# EAGLE design SparkFun_Edge (EAGLE 9.2.0)

## Sheet 1 of 2
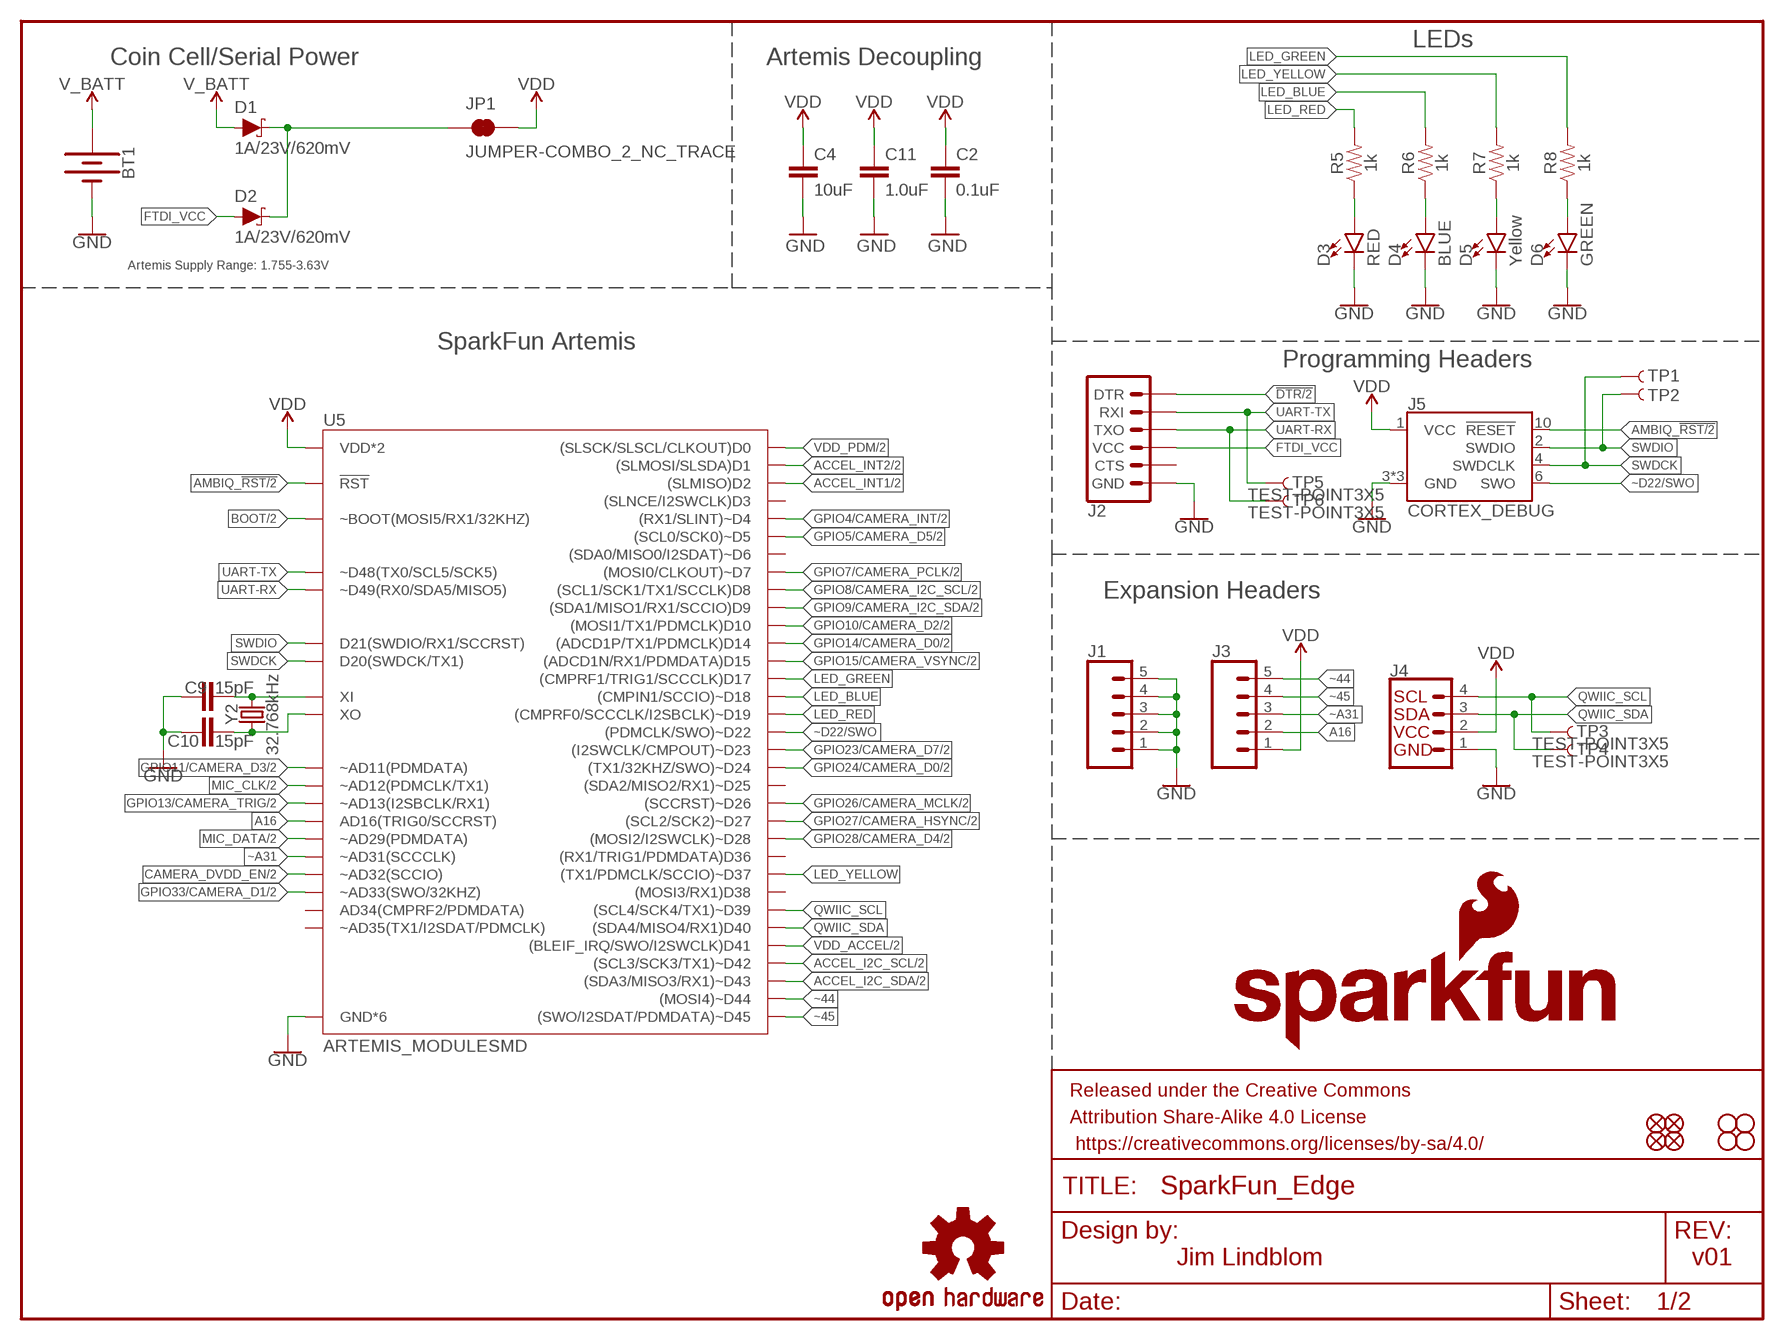
[diagram p0: schematic, sheet 1]

### Parts
BT1  BATTERY-20MM_SMD_4LEGS_OVERPASTE_INNER  [BATTCON_20MM_4LEGS_OVERPASTE_INNER]
C2  0.1uF  0.1UF-0402T-16V-10%  [0402-TIGHT]
C4  10uF  10UF-0603-6.3V-20%  [0603]
C9  15pF  15PF-0402T-50V-5%  [0402-TIGHT]
C10  15pF  15PF-0402T-50V-5%  [0402-TIGHT]
C11  1.0uF  1.0UF-0402T-16V-10%  [0402-TIGHT]
D1  1A/23V/620mV  DIODE-SCHOTTKY-BAT20J  [SOD-323]
D2  1A/23V/620mV  DIODE-SCHOTTKY-BAT20J  [SOD-323]
D3  RED  LED-RED0603  [LED-0603]
D4  BLUE  LED-BLUE0603  [LED-0603]
D5  Yellow  LED-YELLOW0603  [LED-0603]
D6  GREEN  LED-GREEN0603  [LED-0603]
FD1  FIDUCIAL1X2  [FIDUCIAL-1X2]
FD2  FIDUCIAL1X2  [FIDUCIAL-1X2]
FD3  FIDUCIAL1X2  [FIDUCIAL-1X2]
FD4  FIDUCIAL1X2  [FIDUCIAL-1X2]
FRAME1  FRAME-LETTER  [CREATIVE_COMMONS]
H1  STAND-OFF  [STAND-OFF]
H2  STAND-OFF  [STAND-OFF]
H3  STAND-OFF  [STAND-OFF]
H4  STAND-OFF  [STAND-OFF]
J1  CONN_05NO_SILK  [1X05_NO_SILK]
J2  6_PIN_SERIAL_TARGETSMD  [1X06-SMD_RA_MALE]
J3  CONN_05NO_SILK  [1X05_NO_SILK]
J4  QWIIC_CONNECTORJS-1MM  [JST04_1MM_RA]
J5  CORTEX_DEBUG  CORTEX_DEBUG_MINIMUM_PTH  [2X5-PTH-1.27MM]
JP1  JUMPER-COMBO_2_NC_TRACE  [COMBO-JUMPER_2_NC_TRACE]
LOGO1  SFE_LOGO_NAME_FLAME.1_INCH  [SFE_LOGO_NAME_FLAME_.1]
LOGO2  OSHW-LOGOS  [OSHW-LOGO-S]
R5  1k  1KOHM-0603-1/10W-1%  [0603]
R6  1k  1KOHM-0603-1/10W-1%  [0603]
R7  1k  1KOHM-0603-1/10W-1%  [0603]
R8  1k  1KOHM-0603-1/10W-1%  [0603]
TP1  TEST-POINT3X5  [PAD.03X.05]
TP2  TEST-POINT3X5  [PAD.03X.05]
TP3  TEST-POINT3X5  [PAD.03X.05]
TP4  TEST-POINT3X5  [PAD.03X.05]
TP5  TEST-POINT3X5  [PAD.03X.05]
TP6  TEST-POINT3X5  [PAD.03X.05]
U5  ARTEMIS_MODULESMD  [ARTEMIS_FP]
Y2  32.768kHz  CRYSTAL-32.768KHZSMD-3.2X1.5  [CRYSTAL-SMD-3.2X1.5MM]

### Nets
!DTR: J2.1(DTR) ; also sheet 2
A16: J3.2 U5.AD16(AD16(TRIG0/SCCRST))
ACCEL_I2C_SCL: U5.~D42((SCL3/SCK3/TX1)~D42) ; also sheet 2
ACCEL_I2C_SDA: U5.~D43((SDA3/MISO3/RX1)~D43) ; also sheet 2
ACCEL_INT1: U5.D2((SLMISO)D2) ; also sheet 2
ACCEL_INT2: U5.D1((SLMOSI/SLSDA)D1) ; also sheet 2
AMBIQ_!RST: J5.10(!RESET) U5.~RST(!RST) ; also sheet 2
BOOT: U5.BOOT(~BOOT(MOSI5/RX1/32KHZ)) ; also sheet 2
CAMERA_DVDD_EN: U5.~AD32(~AD32(SCCIO)) ; also sheet 2
FTDI_VCC: D2.A J2.4(VCC)
GND: BT1.2(-) C2.1 C4.2 C9.1 C10.1 C11.2 D3.C D4.C D5.C D6.C J1.1 J1.2 J1.3 J1.4 J1.5 J2.6(GND) J4.1 J5.3(GND) J5.5(GND) J5.9(GND) U5.GND@1(GND*6) U5.GND@22(GND*6) U5.GND@38(GND*6) U5.GND@39(GND*6) U5.GND@47(GND*6) U5.GND@59(GND*6) ; also sheet 2
GPIO4/CAMERA_INT: U5.~D4((RX1/SLINT)~D4) ; also sheet 2
GPIO5/CAMERA_D5: U5.~D5((SCL0/SCK0)~D5) ; also sheet 2
GPIO7/CAMERA_PCLK: U5.D7((MOSI0/CLKOUT)~D7) ; also sheet 2
GPIO8/CAMERA_I2C_SCL: U5.D8((SCL1/SCK1/TX1/SCCLK)D8) ; also sheet 2
GPIO9/CAMERA_I2C_SDA: U5.D9((SDA1/MISO1/RX1/SCCIO)D9) ; also sheet 2
GPIO10/CAMERA_D2: U5.D10((MOSI1/TX1/PDMCLK)D10) ; also sheet 2
GPIO11/CAMERA_D3: U5.~AD11(~AD11(PDMDATA)) ; also sheet 2
GPIO13/CAMERA_TRIG: U5.~AD13(~AD13(I2SBCLK/RX1)) ; also sheet 2
GPIO14/CAMERA_D0: U5.D14((ADCD1P/TX1/PDMCLK)D14) ; also sheet 2
GPIO15/CAMERA_VSYNC: U5.D15((ADCD1N/RX1/PDMDATA)D15) ; also sheet 2
GPIO23/CAMERA_D7: U5.~D23((I2SWCLK/CMPOUT)~D23) ; also sheet 2
GPIO24/CAMERA_D0: U5.~D24((TX1/32KHZ/SWO)~D24) ; also sheet 2
GPIO26/CAMERA_MCLK: U5.~D26((SCCRST)~D26) ; also sheet 2
GPIO27/CAMERA_HSYNC: U5.~D27((SCL2/SCK2)~D27) ; also sheet 2
GPIO28/CAMERA_D4: U5.~D28((MOSI2/I2SWCLK)~D28) ; also sheet 2
GPIO33/CAMERA_D1: U5.~AD33/SWO(~AD33(SWO/32KHZ)) ; also sheet 2
LED_BLUE: R6.2 U5.~D18((CMPIN1/SCCIO)~D18)
LED_GREEN: R8.2 U5.D17((CMPRF1/TRIG1/SCCCLK)D17)
LED_RED: R5.2 U5.~D19((CMPRF0/SCCCLK/I2SBCLK)~D19)
LED_YELLOW: R7.2 U5.~D37((TX1/PDMCLK/SCCIO)~D37)
MIC_CLK: U5.~AD12(~AD12(PDMCLK/TX1)) ; also sheet 2
MIC_DATA: U5.~AD29(~AD29(PDMDATA)) ; also sheet 2
N$2: C9.2 U5.XI Y2.P$2
N$5: D4.A R6.1
N$6: D3.A R5.1
N$7: D5.A R7.1
N$8: D6.A R8.1
QWIIC_SCL: J4.4 TP3.P$1 U5.~D39((SCL4/SCK4/TX1)~D39)
QWIIC_SDA: J4.3 TP4.P$1 U5.D40((SDA4/MISO4/RX1)D40)
SWDCK: J5.4(SWDCLK) TP1.P$1 U5.SWDCK(D20(SWDCK/TX1))
SWDIO: J5.2(SWDIO) TP2.P$1 U5.SWDIO(D21(SWDIO/RX1/SCCRST))
UART-RX: J2.3(TXO) TP6.P$1 U5.RXI-0(~D49(RX0/SDA5/MISO5))
UART-TX: J2.2(RXI) TP5.P$1 U5.TXO-0(~D48(TX0/SCL5/SCK5))
V_BATT: BT1.1(+) D1.A
VDD: C2.2 C4.1 C11.1 J3.1 J4.2 J5.1(VCC) JP1.2 JP1.4 U5.VDD@36(VDD*2) U5.VDD@37(VDD*2) ; also sheet 2
VDD_ACCEL: U5.D41((BLEIF_IRQ/SWO/I2SWCLK)D41) ; also sheet 2
VDD_PDM: U5.D0((SLSCK/SLSCL/CLKOUT)D0) ; also sheet 2
VIN1: D1.C D2.C JP1.1 JP1.3
X0: C10.2 U5.XO Y2.P$1
~44: J3.5 U5.~D44((MOSI4)~D44)
~45: J3.4 U5.~D45((SWO/I2SDAT/PDMDATA)~D45)
~A31: J3.3 U5.~AD31(~AD31(SCCCLK))
~D22/SWO: J5.6(SWO) U5.~D22((PDMCLK/SWO)~D22)
Unconnected: J2.5(CTS) U5.AD34(AD34(CMPRF2/PDMDATA)) U5.D3((SLNCE/I2SWCLK)D3) U5.D36((RX1/TRIG1/PDMDATA)D36) U5.D38((MOSI3/RX1)D38) U5.~AD35(~AD35(TX1/I2SDAT/PDMCLK)) U5.~D6((SDA0/MISO0/I2SDAT)~D6) U5.~D25((SDA2/MISO2/RX1)~D25)

### Notes on the sheet
- LEDs
- Coin Cell/Serial Power | Artemis Decoupling
- Artemis Supply Range: 1.755-3.63V
- SparkFun Artemis
- Programming Headers
- Expansion Headers
- Jim Lindblom | v01

## Sheet 2 of 2
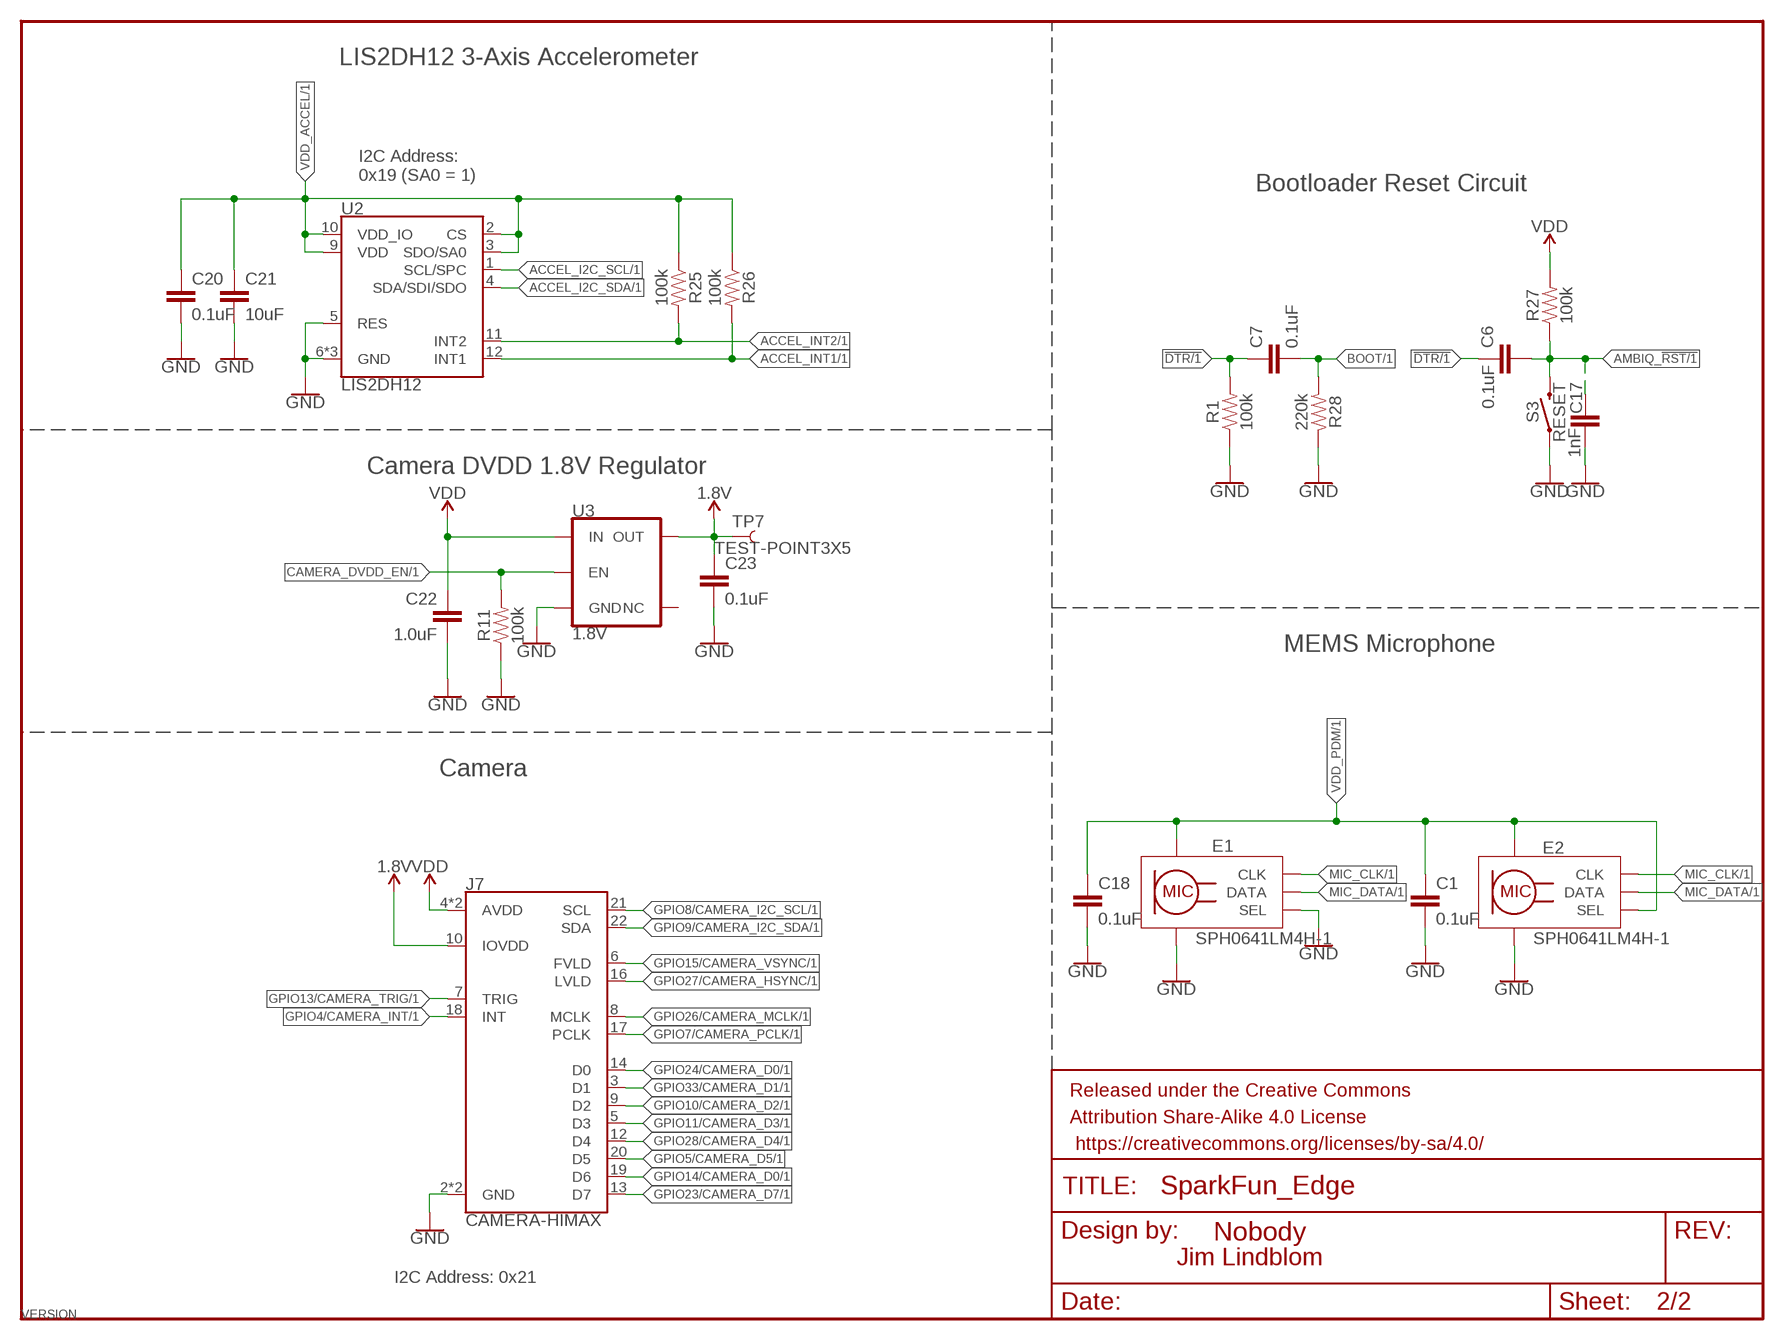
[diagram p1: schematic, sheet 2]

### Parts
C1  0.1uF  0.1UF-0402T-16V-10%  [0402-TIGHT]
C6  0.1uF  0.1UF-0603-25V-5%  [0603]
C7  0.1uF  0.1UF-0603-25V-5%  [0603]
C17  1nF  1.0NF/1000PF-0603-50V-10%  [0603]
C18  0.1uF  0.1UF-0402T-16V-10%  [0402-TIGHT]
C20  0.1uF  0.1UF-0402T-16V-10%  [0402-TIGHT]
C21  10uF  10UF-0603-6.3V-20%  [0603]
C22  1.0uF  1.0UF-0402T-16V-10%  [0402-TIGHT]
C23  0.1uF  0.1UF-0402T-16V-10%  [0402-TIGHT]
E1  SPH0641LM4H-1  SPH0641LM4H-1_MICROPHONE  [SPH0641LM4H-1_MICROPHONE]
E2  SPH0641LM4H-1  SPH0641LM4H-1_MICROPHONE  [SPH0641LM4H-1_MICROPHONE]
FRAME2  FRAME-LETTERNO_PACKAGE  [DUMMY]
J7  CAMERA-HIMAX  [FPC-24-AMPHENOL-SFV24R-1STE1HLF]
R1  100k  100KOHM-0603-1/10W-1%  [0603]
R11  100k  100KOHM-0402T-1/16W-1%  [0402-TIGHT]
R25  100k  100KOHM-0402T-1/16W-1%  [0402-TIGHT]
R26  100k  100KOHM-0402T-1/16W-1%  [0402-TIGHT]
R27  100k  100KOHM-0603-1/10W-1%  [0603]
R28  220k  220KOHM-0603-1/10W-1%  [0603]
S3  RESET  MOMENTARY-SWITCH-SPST-SMD-4.6X2.8MM  [TACTILE_SWITCH_SMD_4.6X2.8MM]
TP7  TEST-POINT3X5  [PAD.03X.05]
U2  LIS2DH12  [LGA-12-LISDH12]
U3  1.8V  V_REG_AP2127K-1.8V  [SOT23-5]

### Nets
1.8V: C23.1 J7.10(IOVDD) TP7.P$1 U3.5(OUT)
!DTR: C6.1 C7.1 R1.2 ; also sheet 1
ACCEL_I2C_SCL: U2.1(SCL/SPC) ; also sheet 1
ACCEL_I2C_SDA: U2.4(SDA/SDI/SDO) ; also sheet 1
ACCEL_INT1: R26.2 U2.12(INT1) ; also sheet 1
ACCEL_INT2: R25.2 U2.11(INT2) ; also sheet 1
AMBIQ_!RST: C6.2 C17.1 R27.1 S3.3 S3.4 ; also sheet 1
BOOT: C7.2 R28.2 ; also sheet 1
CAMERA_DVDD_EN: R11.2 U3.3(EN) ; also sheet 1
GND: C1.2 C17.2 C18.2 C20.2 C21.2 C22.2 C23.2 E1.2(SEL) E1.3(GND) E1.6(GND) E1.7(GND) E1.8(GND) E2.3(GND) E2.6(GND) E2.7(GND) E2.8(GND) J7.2(GND) J7.15(GND) R1.1 R11.1 R28.1 S3.1 S3.2 U2.5(RES) U2.6(GND) U2.7(GND) U2.8(GND) U3.2(GND) ; also sheet 1
GPIO4/CAMERA_INT: J7.18(INT) ; also sheet 1
GPIO5/CAMERA_D5: J7.20(D5) ; also sheet 1
GPIO7/CAMERA_PCLK: J7.17(PCLK) ; also sheet 1
GPIO8/CAMERA_I2C_SCL: J7.21(SCL) ; also sheet 1
GPIO9/CAMERA_I2C_SDA: J7.22(SDA) ; also sheet 1
GPIO10/CAMERA_D2: J7.9(D2) ; also sheet 1
GPIO11/CAMERA_D3: J7.5(D3) ; also sheet 1
GPIO13/CAMERA_TRIG: J7.7(TRIG) ; also sheet 1
GPIO14/CAMERA_D0: J7.19(D6) ; also sheet 1
GPIO15/CAMERA_VSYNC: J7.6(FVLD) ; also sheet 1
GPIO23/CAMERA_D7: J7.13(D7) ; also sheet 1
GPIO24/CAMERA_D0: J7.14(D0) ; also sheet 1
GPIO26/CAMERA_MCLK: J7.8(MCLK) ; also sheet 1
GPIO27/CAMERA_HSYNC: J7.16(LVLD) ; also sheet 1
GPIO28/CAMERA_D4: J7.12(D4) ; also sheet 1
GPIO33/CAMERA_D1: J7.3(D1) ; also sheet 1
MIC_CLK: E1.4(CLK) E2.4(CLK) ; also sheet 1
MIC_DATA: E1.1(DATA) E2.1(DATA) ; also sheet 1
VDD: C22.1 J7.4(AVDD) J7.11(AVDD) R27.2 U3.1(IN) ; also sheet 1
VDD_ACCEL: C20.1 C21.1 R25.1 R26.1 U2.2(CS) U2.3(SDO/SA0) U2.9(VDD) U2.10(VDD_IO) ; also sheet 1
VDD_PDM: C1.1 C18.1 E1.5(VDD) E2.2(SEL) E2.5(VDD) ; also sheet 1
Unconnected: J7.MNT1@0(MNT1) J7.MNT1@1(MNT1) J7.MNT2@0(MNT2) J7.MNT2@1(MNT2) U3.4(NC)

### Notes on the sheet
- LIS2DH12 3-Axis Accelerometer
- I2C Address:
  0x19 (SA0 = 1)
- Bootloader Reset Circuit
- Camera DVDD 1.8V Regulator
- MEMS Microphone
- Camera
- Jim Lindblom
- I2C Address: 0x21

## Library data of the parts
BT1 = SparkFun-Batteries:BATTERY: Battery - Single Cell A variety of battery chemistries, sizes, and footprints. Device List: 20MM_PTH - Coin Cell Battery Holder - 20mm (PTH) <https://www.sparkfun.com/products/783> 20MM_PTH_KIT- Coin Cell battery Holder - 20 mm (PTH) <http://www.sparkfun.com/products/783>kit version with special mask 6.8MM_PTH - Coin Cell Battery Holder - 6.8MM(SMD) <https://www.digikey.com/product-detail/en/seiko-instruments/MS621FE-FL11E/728-1057-ND/1889208?WT.srch=1&gclid=CNOQ5a6LzdQCFZS2wAodXCkE0g> 12MM_SMD - Coin Cell Battery Holder - 12mm (SMD) <https://www.sparkfun.com/products/10592> 12MM_PTH - Coin Cell Battery Holder - 12mm (PTH) <https://www.sparkfun.com/products/7948> 20MM_SMD - 20mm Coin Cell Battery Holder (SMD) (2 legs) Used on the Big Time Watch Kit <https://www.sparkfun.com/products/11734> 20MM_SMD_4LEGS - Coin Cell Battery Holder - 20mm (SMD) <https://www.sparkfun.com/products/11892> 20MM_SMD_4LEGS_OVERPASTE - Coin Cell Battery Holder - 20mm (SMD) <https://www.sparkfun.com/products/11892> (Over-paste on the legs) 24.5MM_PTH - Coin Cell Battery Holder - 24.5mm (PTH) <https://www.sparkfun.com/products/8863> 9V - 9V Battery Holder - PC Mount Used on the SparkFun SparkPunk Sound Kit <https://www.sparkfun.com/products/11177> and SparkFun SparkPunk Sequencer Kit <https://www.sparkfun.com/products/12707> 18650 - Battery Holder - 18650 (PTH) <https://www.sparkfun.com/products/13113> AA - Battery Holder - 1xAA (PTH) <https://www.sparkfun.com/products/7949> AAA - Battery Holder - 1xAAA (PTH) <https://www.sparkfun.com/products/12718> AA_KIT - Battery Holder - 1xAA (PTH) <https://www.sparkfun.com/products/7949> Special kit package - pads only have exposed copper on one side of the board. AAA_KIT - Battery Holder - 1xAAA (PTH) <https://www.sparkfun.com/products/12718> Special kit package - pads only have exposed copper on one side of the board.
C1 C2 C18 C20 C23 = SparkFun-Capacitors:0.1UF: 0.1µF ceramic capacitors A capacitor is a passive two-terminal electrical component used to store electrical energy temporarily in an electric field.; PROD_ID: CAP-12416
C4 C21 = SparkFun-Capacitors:10UF: 10.0µF ceramic capacitors A capacitor is a passive two-terminal electrical component used to store electrical energy temporarily in an electric field.; PROD_ID: CAP-11015
C6 C7 = SparkFun-Capacitors:0.1UF: 0.1µF ceramic capacitors A capacitor is a passive two-terminal electrical component used to store electrical energy temporarily in an electric field.; PROD_ID: CAP-08604
C9 C10 = SparkFun-Capacitors:15PF: 15pF ceramic capacitors A capacitor is a passive two-terminal electrical component used to store electrical energy temporarily in an electric field.; PROD_ID: CAP-13063
C11 C22 = SparkFun-Capacitors:1.0UF: 1µF ceramic capacitors A capacitor is a passive two-terminal electrical component used to store electrical energy temporarily in an electric field.; PROD_ID: CAP-12417
C17 = SparkFun-Capacitors:1.0NF/1000PF: 1nF/1,000pF ceramic capacitors A capacitor is a passive two-terminal electrical component used to store electrical energy temporarily in an electric field.; PROD_ID: CAP-07886
D1 D2 = SparkFun-DiscreteSemi:DIODE-SCHOTTKY: Schottky diode A Schottky diode is a semiconductor diode which has a low forward voltage drop and a very fast switching action.; PROD_ID: DIO-11623
D3 = SparkFun-LED:LED-RED: Red SMD LED Used in manufacturing of most products at SparkFun Packages: 0603 - SMD 0603 package [Product Link] <http://docs.avagotech.com/docs/AV02-0551EN> 0603 SMART - SMD 0603 SMART package ( more efficient and expensive)[Product Link] <http://www.osram-os.com/Graphics/XPic2/00077099_0.pdf> 1206 - SMD1206 package [Product Link] <https://www.sparkfun.com/datasheets/DevTools/LilyPad/Q150OVS4.pdff> SparkFun Products: Pro Mini 328 -5V <https://www.sparkfun.com/products/821> RedBoard <https://www.sparkfun.com/products/12757> IOIO-OTG <https://www.sparkfun.com/products/13613>; PROD_ID: DIO-00819
D4 = SparkFun-LED:LED-BLUE: Blue SMD LED Used in manufacturing of various products at SparkFun Packages: 0603 - SMD 0603 package [Product Link] <http://www.digikey.com/product-detail/en/SMLE12BC7TT86/511-1589-2-ND/1641808> 1206 - SMD1206 package [Product Link] <http://www.digikey.com/product-detail/en/lite-on-inc/LTST-C150TBKT/160-1643-1-ND/573584> SparkFun Products: ESP8266 Thing-Dev Board <https://www.sparkfun.com/products/13711> RedBoard <https://www.sparkfun.com/products/12757>; PROD_ID: DIO-08575
D5 = SparkFun-LED:LED-YELLOW: Yellow SMD LED Used in manufacturing several products at SparkFun. Packages: 0603 - SMD 0603 package[Product Link] <http://www.kingbrightusa.com/product.asp?catalog_name=LED&product_id=APT1608SYCK> 0603 -SMART - SMART SMD 0603 package (more efficient/more expensive) [Product Link] <http://www.osram-os.com/osram_os/en/products/product-catalog/led-light-emitting-diodes/smartled-0603/ly-l29k/index.jsp> LilyPad - SMD1206 package[Product Datasheet] <https://www.sparkfun.com/datasheets/DevTools/LilyPad/Q150YUS4.pdf> SparkFun Products: Blynk Board <https://www.sparkfun.com/products/13794> IOIO-OTG <https://www.sparkfun.com/products/13613> XBee Explorer Serial <https://www.sparkfun.com/products/13225>; PROD_ID: DIO-09003
D6 = SparkFun-LED:LED-GREEN: Green SMD LED Used in manufacturing of various products at SparkFun Packages: 0603 - SMD 0603 package [Product Link] <http://www.futureelectronics.com/en/technologies/semiconductors/optoelectronics/leds/Pages/9894312-LTST-C190GKT.aspx?CrossPart=HSMG-C190&IM=0> LilyPad 1206 - SMD1206 LilyPad package [Product Link] <http://www.futureelectronics.com/en/Technologies/Product.aspx?ProductID=IN150NGHARVATEKCORPORATION2049943&IM=0> 1206 - SMD1206 package [Product Link] <http://www.futureelectronics.com/en/technologies/semiconductors/optoelectronics/leds/Pages/8315665-LTST-C150KGKT.aspx?IM=0> 1206 Bottom Mount -SMD 1206 Bottom Mount [Product Link] <http://www.digikey.com/product-detail/en/lite-on-inc/LTST-C230KGKT/160-1456-1-ND/386854> SparkFun Products: Pro Mini 328 -5V <https://www.sparkfun.com/products/821> RedBoard <https://www.sparkfun.com/products/12757> MP3 Trigger <https://www.sparkfun.com/products/13720> Makey Makey <https://www.sparkfun.com/products/11076>; PROD_ID: DIO-00821
E1 E2 = SparkFun-Sensors:SPH0641LM4H-1_MICROPHONE: SPH0641LM4H-1 Microphone A miniature, high-performance, low power, bottom port silicon digital microphone with a single bit PDM output.; PROD_ID: IC-14361
FD1-FD4 = SparkFun-Aesthetics:FIDUCIAL: Fiducial Alignment Points Point-of-reference for pick-and-place machines and other optical instruments.
FRAME1 = SparkFun-Aesthetics:FRAME-LETTER: Schematic Frame - Letter Standard 8.5x11 US Letter frame
FRAME2 = SparkFun-Aesthetics:FRAME-LETTER: Schematic Frame - Letter Standard 8.5x11 US Letter frame; DESIGNER: Nobody; VERSION: x01
H1-H4 = SparkFun-Hardware:STAND-OFF: Stand Off Drill holes for mechanically mounting via screws, standoffs, etc. Note: Use the keepout ring to avoid running the screw head into surrounding components. Variant Overviews STAND-OFF - Mechanical footprint for a #4 phillips button head screw. STAND-OFF-TIGHT - Mechanical footprint for a #4 phillips button head screw, Example SparkFun Products Screw - Phillips Head (1/4", 4-40, 10 pack) <https://www.sparkfun.com/products/10453> (PRT-10453) Screw - Phillips Head (1/2", 4-40, 10 pack) <https://www.sparkfun.com/products/10452> (PRT-10452) Screw - Phillips Head (3/4", 4-40, 10 pack) <https://www.sparkfun.com/products/10451> (PRT-10451) Screw - Phillips Head (1", 4-40, 10 pack) <https://www.sparkfun.com/products/10450> (PRT-10450)
J1 J3 = SparkFun-Connectors:CONN_05: Multi connection point. Often used as Generic Header-pin footprint for 0.1 inch spaced/style header connections On any of the 0.1 inch spaced packages, you can populate with these: Break Away Headers - Straight <https://www.sparkfun.com/products/116> (PRT-00116) Break Away Male Headers - Right Angle <https://www.sparkfun.com/products/553> (PRT-00553) Female Headers <https://www.sparkfun.com/products/115> (PRT-00115) Break Away Headers - Machine Pin <https://www.sparkfun.com/products/117> (PRT-00117) Break Away Female Headers - Swiss Machine Pin <https://www.sparkfun.com/products/743> (PRT-00743) For SCREWTERMINALS and SPRING TERMINALS visit here: Screw Terimnals on SparkFun.com <https://www.sparkfun.com/search/results?term=Screw+Terminals> (5mm/3.5mm/2.54mm spacing) This device is also useful as a general connection point to wire up your design to another part of your project. Our various solder wires solder well into these plated through hole pads. Hook-Up Wire - Assortment (Stranded, 22 AWG) <https://www.sparkfun.com/products/11375> (PRT-11375) Hook-Up Wire - Assortment (Solid Core, 22 AWG) <https://www.sparkfun.com/products/11367> (PRT-11367) View the entire wire category on our website here <https://www.sparkfun.com/categories/141> Special notes: Molex polarized connector foot print use with SKU : PRT-08231 with associated crimp pins and housings. 1MM SMD Version SKU: PRT-10208
J2 = SparkFun-Connectors:6_PIN_SERIAL_TARGET: 6-pin header connection for use with the "FTDI BASIC" pinout - TARGET SIDE. Also known as "Arduino Serial Program Header". It is used to mate with our FTDI Basic serial programmers using the Arduino IDE. Note, this device has "TARGET" in the name. It is intended to be used on a design that contains a target micro-controller that you wish to program. The "sister" device, named "CABLE" is inteneded to be used on a design that usually lives on the end of your USB cable and prvides the converter chip (FTDI232 or FTDI231x) to commnicate serial RX/TX. You can populate with some of these: Break Away Headers - Straight <https://www.sparkfun.com/products/116> (PRT-00116) For reference (or to suit your programming needs) check out these designs: SparkFun FTDI Basic Breakout - 5V <https://www.sparkfun.com/products/9716> (DEV-09716) SparkFun FTDI Basic Breakout - 3.3V <https://www.sparkfun.com/products/9873> (DEV-09873) SparkFun FTDI SmartBasic <https://www.sparkfun.com/products/12935> (DEV-12935) SparkFun Beefy 3 - FTDI Basic Breakout <https://www.sparkfun.com/products/13746> (DEV-13746); PROD_ID: CONN-08971
J4 = SparkFun-Connectors:QWIIC_CONNECTOR: SparkFun I2C Standard Qwiic Connector An SMD 1mm pitch JST connector makes it easy and quick (get it? Qwiic?) to connect I2C devices to each other. The Qwiic system <http://www.sparkfun.com/qwiic> enables fast and solderless connection between popular platforms and various sensors and actuators. We carry 200mm <https://www.sparkfun.com/products/14204>, 100mm <https://www.sparkfun.com/products/14205>, 50mm <https://www.sparkfun.com/products/14206>, and breadboard friendly <https://www.sparkfun.com/products/14207> Qwiic cables. We also offer 10 pcs strips <https://www.sparkfun.com/products/14323> the SMD connectors.; PROD_ID: CONN-13694
J5 = SparkFun-Connectors:CORTEX_DEBUG_MINIMUM: Cortex Debug Connector - 10 pin Supports JTAG debug, Serial Wire debug, and Serial Wire Viewer. PTH and SMD connector options available. General Connector Information <http://infocenter.arm.com/help/topic/com.arm.doc.faqs/attached/13634/cortex_debug_connectors.pdf> Products: PTH Connector <http://www.digikey.com/product-detail/en/cnc-tech/3220-10-0100-00/1175-1627-ND/3883661> -via Digi-Key SparkFun PSoc <https://www.sparkfun.com/products/13229> SparkFun T <https://www.sparkfun.com/products/13810>
J7 = SparkFun-Connectors:CAMERA-HIMAX; DIGIKEY: 609-4320-2-ND; PROD_ID: CONN-14233
JP1 = SparkFun-Jumpers:JUMPER-COMBO_2_NC_TRACE
LOGO1 = SparkFun-Aesthetics:SFE_LOGO_NAME_FLAME: SparkFun Font Logo w/ Flame This is the SparkFun full logo. The logo on the schematic will always be the same size; the package variant is the height of the flame part of the logo. Default layer for the logo on the board is tSilk.
LOGO2 = SparkFun-Aesthetics:OSHW-LOGO: Open-Source Hardware (OSHW) Logo This logo indicates the piece of hardware it is found on incorporates a OSHW license and/or adheres to the definition of open source hardware found here: http://freedomdefined.org/OSHW
R1 R27 = SparkFun-Resistors:100KOHM: 100kΩ resistor A resistor is a passive two-terminal electrical component that implements electrical resistance as a circuit element. Resistors act to reduce current flow, and, at the same time, act to lower voltage levels within circuits. - Wikipedia; PROD_ID: RES-07828
R5-R8 = SparkFun-Resistors:1KOHM: 1kΩ resistor A resistor is a passive two-terminal electrical component that implements electrical resistance as a circuit element. Resistors act to reduce current flow, and, at the same time, act to lower voltage levels within circuits. - Wikipedia; PROD_ID: RES-07856
R11 R25 R26 = SparkFun-Resistors:100KOHM: 100kΩ resistor A resistor is a passive two-terminal electrical component that implements electrical resistance as a circuit element. Resistors act to reduce current flow, and, at the same time, act to lower voltage levels within circuits. - Wikipedia; PROD_ID: RES-13495
R28 = SparkFun-Resistors:220KOHM: 220kΩ resistor A resistor is a passive two-terminal electrical component that implements electrical resistance as a circuit element. Resistors act to reduce current flow, and, at the same time, act to lower voltage levels within circuits. - Wikipedia; PROD_ID: RES-08969
S3 = SparkFun-Switches:MOMENTARY-SWITCH-SPST: Momentary Switch (Pushbutton) - SPST Normally-open (NO) SPST momentary switches (buttons, pushbuttons). Variants PTH-12MM - 12mm square, through-hole Momentary Pushbutton Switch - 12mm Square <https://www.sparkfun.com/products/9190> (COM-09190) PTH-6.0MM, PTH-6.0MM-KIT - 6.0mm square, through-hole Mini Pushbutton Switch <https://www.sparkfun.com/products/97> (COM-00097) KIT package intended for soldering kit's - only one side of pads' copper is exposed. PTH-RIGHT-ANGLE-KIT - Right-angle, through-hole Right Angle Tactile Button <https://www.sparkfun.com/products/10791> - Used on SparkFun BigTime Watch Kit <https://www.sparkfun.com/products/11734> SMD-12MM - 12mm square, surface-mount Tactile Button - SMD (12mm) <https://www.sparkfun.com/products/12993> (COM-12993) Used on SparkFun PicoBoard <https://www.sparkfun.com/products/11888> SMD-4.5MM - 4.5mm Square Trackball Switch Used on SparkFun Blackberry Trackballer Breakout <https://www.sparkfun.com/products/13169> SMD-4.6MMX2.8MM - 4.60mm x 2.80mm, surface mount Used on SparkFun SAMD21 Mini Breakout <https://www.sparkfun.com/products/13664> SMD-5.2MM, SMD-5.2-REDUNDANT - 5.2mm square, surface-mount Mini Pushbutton Switch - SMD <https://www.sparkfun.com/products/8720> (COM-08720) Used on Arduino Pro Mini <https://www.sparkfun.com/products/11114> REDUNDANT package connects both switch circuits together SMD-6.0X3.5MM - 6.0 x 3.5mm, surface mount Momentary Reset Switch SMD <https://www.sparkfun.com/products/8229> (COM-08229) SMD-6.2MM-TALL - 6.2mm square, surface mount Tactile Button - SMD (6mm) <https://www.sparkfun.com/products/12992> Used on SparkFun Digital Sandbox <https://www.sparkfun.com/products/12651> SMD-RIGHT-ANGLE - Right-angle, surface mount Used on SparkFun Block for Intel® Edison - Arduino <https://www.sparkfun.com/products/13036>; PROD_ID: SWCH-13065
TP1-TP7 = SparkFun-Connectors:TEST-POINT: SparkFun Test Points Bare copper test points for troubleshooting or In-Circuit-Testing. These are used by our Production team for verifying production board runs using pogo-pins on test beds. SparkFun Products: SparkFun LSM9DS1 Breakout <https://www.sparkfun.com/products/13284> SparkFun PSOC <https://www.sparkfun.com/products/13714> SparkFun Load Cell Amplifier <https://www.sparkfun.com/products/13879>
U2 = SparkFun-Sensors:LIS2DH12; DIGIKEY: 497-14851-2-ND; PROD_ID: IC-14229
U3 = SparkFun-IC-Power:V_REG_AP2127: AP2127 - 300mA CMOS LDO Regulator w/ Enable The AP2127 is CMOS process low dropout linear regulator with enable function, the regulator delivers a guaranteed 300mA (min.) continuous load current. Features Output Voltage Accuracy: ±1.5% Output Current: 300mA (Min.) Foldback Short Current Protection: 50mA Enable Function to Turn ON/OFF VOUT Low Dropout Voltage (3.3V): 250mV (Typ.) @IOUT=600mA Excellent Load Regulation: 0.2%/A (Typ.) Excellent Line Regulation: 0.02%/V (Typ.) Low Quiescent Current: 55μA (Typ.) Low Standby Current: 0.01μA (Typ.) Low Output Noise: 50μVRMS PSRR: 100Hz -65dB, 1kHz -65dB OTSD Protection Stable with 1.0μF Flexible Cap: Ceramic, Tantalum and Aluminum Electrolytic Operation Temperature Range: -40°C to 85°C ESD: MM 400V, HBM 4000V; PROD_ID: VREG-14239
U5 = SparkFun-IC-Microcontroller:ARTEMIS_MODULE: Description: The Artemis Module from SparkFun is a Cortex-M4F with BLE 5.0 running up to 96MHz and with as low power as 6uA per MHz (less than 5mW). This is the world's first module to bridge the market between hobbyists and consumer products. We've packaged all the power of a modern microcontroller into a module that is both extremely easy to use but is mass-market ready. The flexibility of the Artemis module starts with our [Arduino core](https://github.com/sparkfun/Arduino_Apollo3). You can program and use the Artemis module just like you would an Uno or any other Arduino. Time to first blink is just 5 minutes away! We built the core from the ground up, making it fast and as light weight as possible.; PROD_ID: SUB-14402
Y2 = SparkFun-Clocks:CRYSTAL-32.768KHZ: 32.768kHz Crystal Frequency: 32.768kHz Frequency Stability: ±20ppm Load Capacitance: 12.5pF (PTH-2X6 & SMD-3.2X1.5), 6pF (SMD-2X6) SparkFun Products: SparkFun BigTime Watch Kit <https://www.sparkfun.com/products/11734> SparkFun nRF52832 Breakout <https://www.sparkfun.com/products/13990> SparkFun Real Time Clock Module <https://www.sparkfun.com/products/12708>; PROD_ID: XTAL-13062

## Net classes
2 usb: width 0.254 mm, drill 0.305 mm, clearance 0.254 mm

## Board
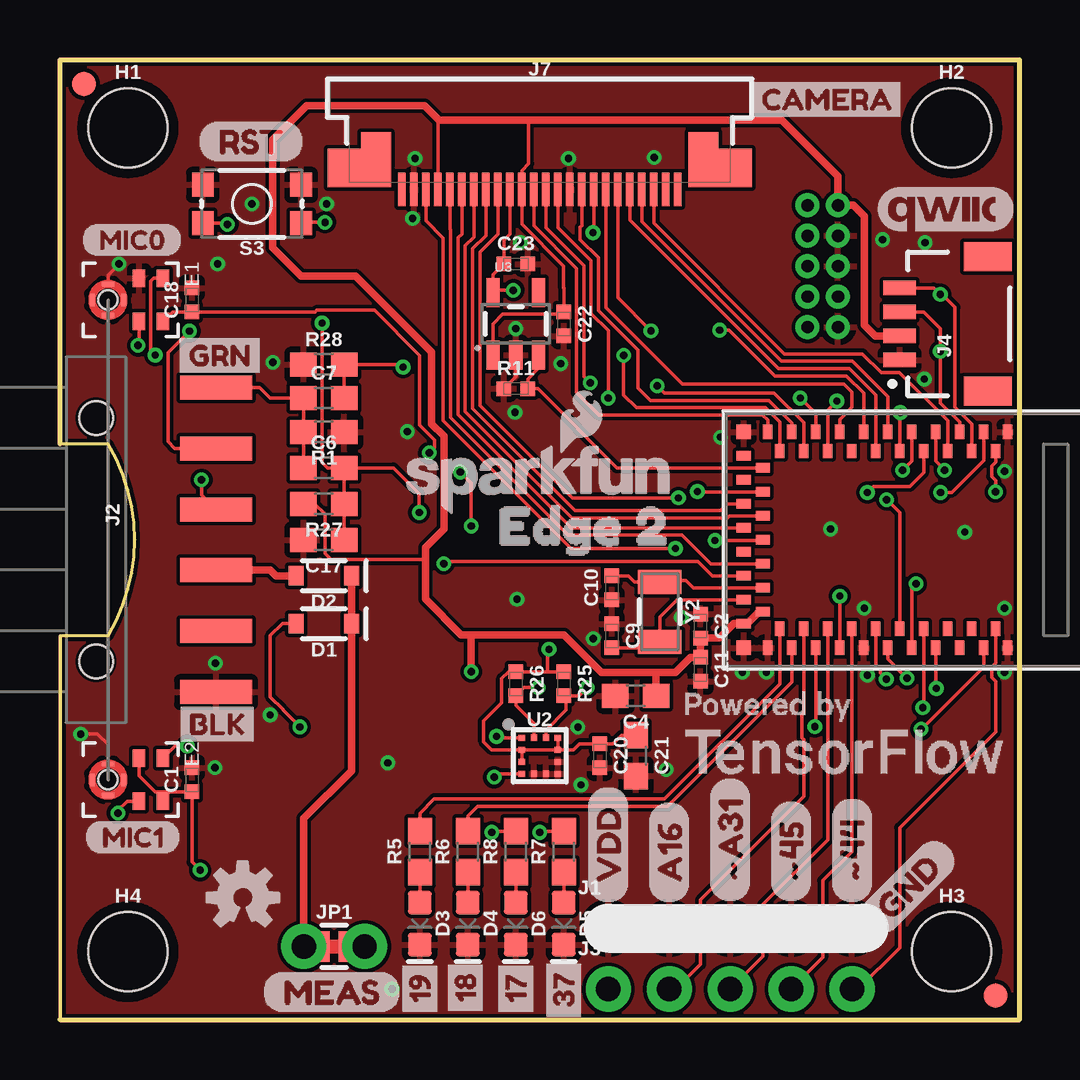
[diagram p2: board, top side]
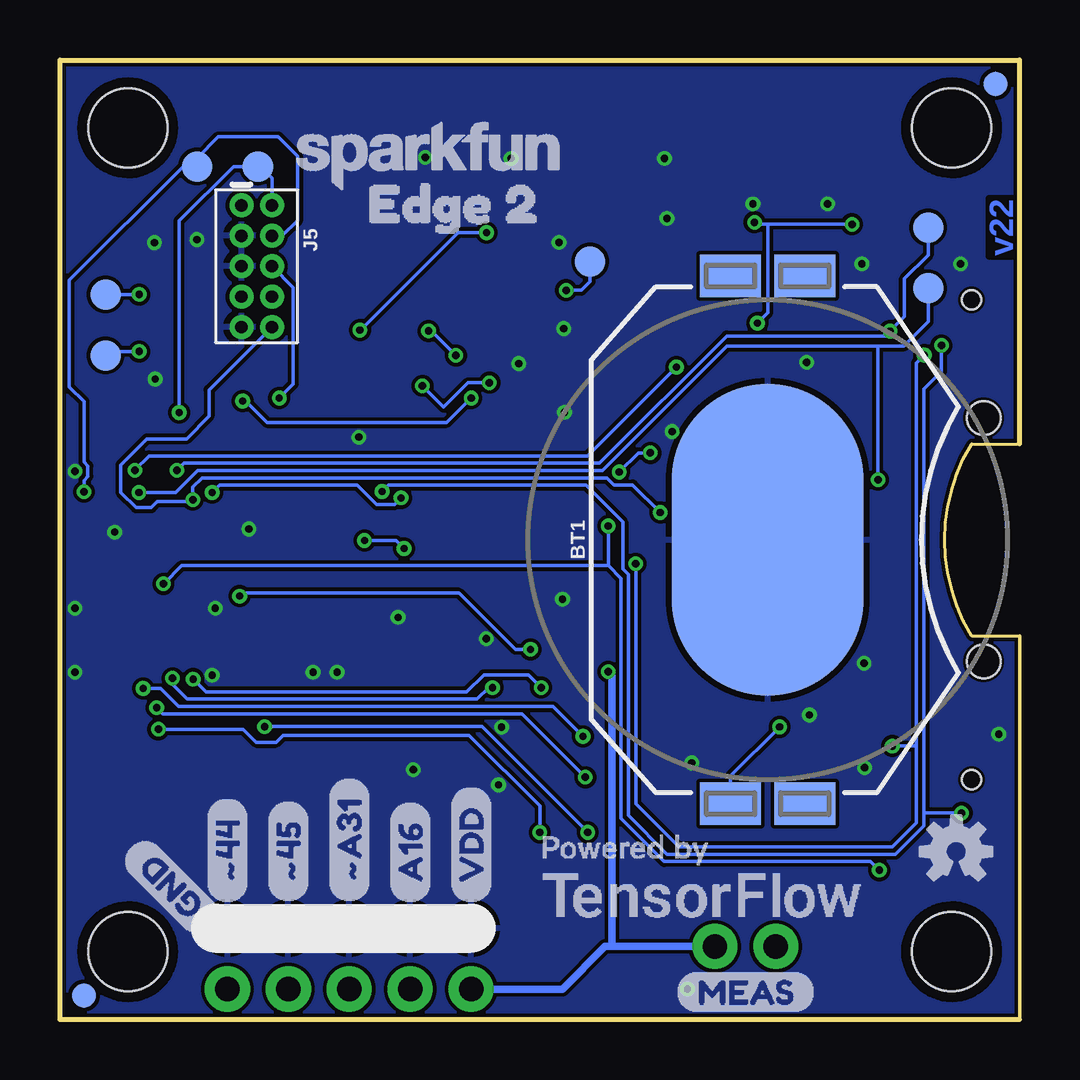
[diagram p3: board, bottom side, seen from below]

Size 40 x 40 mm. Coordinates in mm from the lower left corner, seen from the top.
Outline: 0,0 40,0 40,40 0,40 0,24 2,24 arc-62 2,16 0,16 0,0
Copper layers (1*16): Top 0.035mm / dielectric 1.5mm / Bottom 0.035mm
Design rules "SparkFun-2-layer-PCBWay-LIMIT *": minimum track width 6mil, minimum drill 0.3mm, track to track 6mil, track to pad 6mil, pad to pad 6mil, via to via 6mil, smd to smd 6mil, copper to edge 6mil, drill to drill 6mil, minimum pad ring 6mil, minimum via ring 6mil, stop-mask expansion 4mil, vias tented up to drill 25mil, thermal gap 10mil

### Footprints (pad centres in the part's own frame; a part is rotated, then mirrored left to right if it is on the bottom)
BATTCON_20MM_4LEGS_OVERPASTE_INNER = smd 1.778 x 2.54: 1 -11,1.55; 3 11,1.55; P$1 -11,-1.55; P$2 11,-1.55 | smd 13 x 8: 2 0,0
0402-TIGHT = smd 0.6 x 0.6: 1 -0.5,0; 2 0.5,0
0603 = smd 1.1 x 1: 1 -0.85,0; 2 0.85,0
SOD-323 = smd 0.63 x 0.83: A 1.15,0; C -1.15,0
LED-0603 = smd 1 x 1: A -0.877,0; C 0.877,0
SPH0641LM4H-1_MICROPHONE = smd 0.725 x 0.522: 1 -0.9,1.3; 2 -0.9,0.3; 4 0.9,0.3; 5 0.9,1.3 | smd 0.5 x 0.2: 3 0,-1.65; 8 0,-0.35 | smd 0.2 x 0.5: 6 -0.65,-1; 7 0.65,-1 | hole 0.8: 0,-1
FIDUCIAL-1X2 = smd 1 x 1: 1 0,0
STAND-OFF = hole 3.302: 0,0
1X05_NO_SILK = drill 1.016 pad 1.88: 1 0,0; 2 2.54,0; 3 5.08,0; 4 7.62,0; 5 10.16,0
1X06-SMD_RA_MALE = smd 1 x 3: 1 -6.35,5; 2 -3.81,5; 3 -1.27,5; 4 1.27,5; 5 3.81,5; 6 6.35,5 | hole 1.4: -5.08,0; 5.08,0
JST04_1MM_RA = smd 0.6 x 1.35: 1 -1.5,0; 2 -0.5,0; 3 0.5,0; 4 1.5,0 | smd 1.2 x 2: NC1 2.8,-3.675; NC2 -2.8,-3.675
2X5-PTH-1.27MM = drill 0.508 pad 1: 1 -2.54,-0.635; 2 -2.54,0.635; 3 -1.27,-0.635; 4 -1.27,0.635; 5 0,-0.635; 6 0,0.635; 7 1.27,-0.635; 8 1.27,0.635; 9 2.54,-0.635; 10 2.54,0.635
FPC-24-AMPHENOL-SFV24R-1STE1HLF = smd 0.3 x 1.4: 1 5.75,2.4; 2 5.25,2.4; 3 4.75,2.4; 4 4.25,2.4; 5 3.75,2.4; 6 3.25,2.4; 7 2.75,2.4; 8 2.25,2.4; 9 1.75,2.4; 10 1.25,2.4; 11 0.75,2.4; 12 0.25,2.4; 13 -0.25,2.4; 14 -0.75,2.4; 15 -1.25,2.4; 16 -1.75,2.4; 17 -2.25,2.4; 18 -2.75,2.4; 19 -3.25,2.4; 20 -3.75,2.4; 21 -4.25,2.4; 22 -4.75,2.4; 23 -5.25,2.4; 24 -5.75,2.4 | smd 1.4 x 1.6: MNT1@0 -8.15,1.5; MNT2@1 8.15,1.5 | smd 1.25 x 2.3: MNT1@1 -6.825,1.15; MNT2@0 6.825,1.15
COMBO-JUMPER_2_NC_TRACE = smd 0.635 x 1.27: 1 -0.508,0; 2 0.508,0 | drill 1.016 pad 1.88: 3 -1.27,0; 4 1.27,0
TACTILE_SWITCH_SMD_4.6X2.8MM = smd 0.9 x 1: 1 -2.05,-0.8; 2 2.05,-0.8; 3 2.05,0.8; 4 -2.05,0.8
PAD.03X.05 = smd 1.27 x 1.27: P$1 0,0
LGA-12-LISDH12 = smd 0.275 x 0.25: 1 -0.75,0.75; 2 -0.75,0.25; 3 -0.75,-0.25; 4 -0.75,-0.75; 7 0.75,-0.75; 8 0.75,-0.25; 9 0.75,0.25; 10 0.75,0.75 | smd 0.25 x 0.275: 5 -0.25,-0.75; 6 0.25,-0.75; 11 0.25,0.75; 12 -0.25,0.75
SOT23-5 = smd 0.55 x 1.2: 1 -0.95,-1.3; 2 0,-1.3; 3 0.95,-1.3; 4 0.95,1.3; 5 -0.95,1.3
ARTEMIS_FP = smd 0.4 x 0.6: AD16 -4,-3.7; BOOT 1.5,4.5; D0 0.5,-4.5; D1 -0.5,-4.5; D2 -1,-3.7; D3 2,-3.7; D7 -1.5,4.5; D8 -0.5,4.5; D9 2,3.7; D10 1,3.7; D14 -5,3.7; D17 -3.5,-4.5; D36 2.5,-4.5; D38 3,-3.7; D40 2.5,4.5; D41 -2.5,-4.5; GND@1 4.5,4.5; GND@39 -5.5,-4.5; GND@47 -1.5,-4.5; GND@59 4.5,-4.5; RXI-0 3.5,4.5; SWDCK 4,3.7; SWDIO 0,3.7; TXO-0 0.5,4.5; ~AD31 -3,-3.7; ~AD35 -2,3.7; ~D4 -2.5,4.5; ~D5 -1,3.7; ~D18 -4.5,-4.5; ~D19 -5,-3.7; ~D22 -3.5,4.5; ~D23 -4,3.7; ~D24 -3,3.7; ~D27 -4.5,4.5; ~D28 -5.5,4.5; ~D37 3.5,-4.5; ~D39 3,3.7; ~D42 1.5,-4.5; ~D43 1,-3.7; ~D44 4,-3.7; ~D45 -2,-3.7; ~RST 0,-3.7 | smd 0.6 x 0.4: AD34 -6.5,-0.5; D15 -6.5,0.5; VDD@36 -5.7,-3; VDD@37 -6.5,-3.5; XI -6.5,-2.5; XO -5.7,-2; ~AD11 -5.7,-1; ~AD12 -5.7,2; ~AD13 -5.7,1; ~AD29 -6.5,-1.5; ~AD32 -5.7,3; ~AD33/SWO -5.7,0; ~D6 -6.5,3.5; ~D25 -6.5,2.5; ~D26 -6.5,1.5 | smd 0.6 x 0.6: GND@22 -6.5,4.5; GND@38 -6.5,-4.5
CRYSTAL-SMD-3.2X1.5MM = smd 1 x 1.8: P$1 -1.25,0; P$2 1.25,0

### Placement (x,y rotation side)
BT1  10.5,20 90 bottom
C1  5.5,10 90 top
C2  26.7,16.4 270 top
C4  24,13.5 180 top
C6  11,23 0 top
C7  11,25.9 0 top
C9  23,16 270 top
C10  23,18 90 top
C11  26.7,14.6 270 top
C17  11,20 180 top
C18  5.5,30 90 top
C20  22.5,11 270 top
C21  24,11 270 top
C22  21,29 270 top
C23  19,31.5 0 top
D1  11,16.5 180 top
D2  11,18.5 180 top
D3  15,4 270 top
D4  17,4 270 top
D5  21,4 270 top
D6  19,4 270 top
E1  3,30 270 top
E2  3,10 270 top
FD1  1,39 0 top
FD2  39,1 0 top
FD3  39,1 0 bottom
FD4  1,39 0 bottom
FRAME1  1,-13 0 top  (outside the outline)
FRAME2  1,-13 0 top  (outside the outline)
H1  2.83,37.17 0 top
H2  37.17,37.17 0 top
H3  37.17,2.83 0 top
H4  2.83,2.83 0 top
J1  22.86,3.81 0 top
J2  1.5,20 270 top
J3  22.86,1.27 0 top
J4  35,29 90 top
J5  31.8,31.4 270 bottom
J7  20,37 180 top
JP1  11.43,3.05 0 top
LOGO1  20,22.52 0 top
LOGO2  7.62,5.08 0 top
R1  11,24.5 180 top
R5  15,7 90 top
R6  17,7 90 top
R7  21,7 90 top
R8  19,7 90 top
R11  19,26.3 0 top
R25  21,14 270 top
R26  19,14 270 top
R27  11,21.5 180 top
R28  11,27.3 0 top
S3  8,34 180 top
TP1  34.29,35.56 0 bottom
TP2  31.75,35.56 0 bottom
TP3  38.1,30.23 0 bottom
TP4  38.1,27.69 0 bottom
TP5  3.81,33.02 0 bottom
TP6  3.81,30.48 0 bottom
TP7  17.9,31.6 0 bottom
U2  20,11 0 top
U3  19,29 0 top
U5  35,20 0 top
U$1  [MIC00]  0.9,32.5 0 top
U$2  [BLK2]  4.57,12.32 0 top
U$3  [GND0]  33.66,3.81 45 top
U$4  [VDD1]  22.86,4.83 90 top
U$5  [#453]  30.48,4.83 90 top
U$6  [#A312]  27.94,4.83 90 top
U$7  [A161]  25.4,4.83 90 top
U$8  [MIC10]  1,7.6 0 top
U$9  [VDD1]  22.86,4.83 90 bottom
U$10  [A161]  25.4,4.83 90 bottom
U$11  [#A312]  27.94,4.83 90 bottom
U$12  [#453]  30.48,4.83 90 bottom
U$13  [#444]  33.02,4.83 90 bottom
U$14  [GND0]  33.66,3.81 135 bottom
U$15  [EDGE_20]  16.89,20.57 0 top
U$16  [372]  21,-0.3 90 top
U$19  [QWIIC_COPYRIGHT_SMALL]  36.9,33.8 0 top
U$20  [CAMERA3]  28.45,38.35 0 top
U$21  [POWEREDBY_TF#JPG]  32.6,12.2 0 top
U$23  [171]  19,-0.1 90 top
U$24  [MEAS10]  14.35,1.14 0 bottom
U$25  [POWEREDBY_TF#JPG]  13.34,6.22 0 bottom
U$26  [182]  16.9,-0.1 90 top
U$27  [RST15]  5.7,36.6 0 top
U$28  [GRN1]  4.57,27.69 0 top
U$29  [SFE_LOGO_NAME_.1]  24.64,36 0 bottom
U$30  [OSHW-LOGO-S]  2.64,7 0 bottom
U$31  [193]  15,-0.1 90 top
U$32  [EDGE_20]  28.54,34 0 bottom
U$35  [MEAS10]  8.38,1.14 0 top
U$36  [#444]  33.02,4.83 90 top
Y2  25,17 270 top

### Tracks (layer width: path | path; a pad name or v marks a point on that pad's centre or on a via)
1.8V  (via drill 0.3)
  Top 0.152: J7.10 18.75,33.53 18.75,32.75 18.5,32.5 C23.1 18.05,31.05 U3.5 18.15,30.4 v18.9,30.4
  Bottom 0.152: TP7.P$1 17.9,30.77 18.27,30.4 v18.9,30.4
!DTR
  Top 0.152: J2.1 8.32,26.35 8.76,25.91 8.76,25.9 C7.1 R1.2 C6.1
A16
  Top 0.152: J3.2 25.67,1.27 26.7,2.3 26.7,5 31,9.3 31,11.67 30.93,11.74 30.93,12.69 31,12.75 U5.AD16
ACCEL_I2C_SCL  (via drill 0.3)
  Top 0.152: U2.1 18.25,11.75 v18.2,11.8 | U5.~D42 36.5,13.83 v36.53,13.8
  Bottom 0.152: v36.53,13.8 35.8,13.8 35.05,13.05 19.45,13.05 v18.2,11.8
ACCEL_I2C_SDA  (via drill 0.3)
  Top 0.152: U2.4 18.25,10.25 v18.1,10.1 | U5.~D43 36,13.03 v35.97,13
  Bottom 0.152: v35.97,13 35.71,12.75 20.75,12.75 v18.1,10.1
ACCEL_INT1  (via drill 0.3)
  Top 0.152: U2.12 19.75,12.35 19,13.1 R26.2 19.34,13.84 v19.94,13.84 | U5.D2 34,14.76 34.19,14.57 34.19,14.45 v34.45,14.19
  Bottom 0.152: v19.94,13.84 20.47,14.37 22.33,14.37 23.04,13.66 33.91,13.66 v34.45,14.19
ACCEL_INT2  (via drill 0.3)
  Top 0.152: U2.11 20.25,12.05 21.1,12.9 21.1,13.4 R25.2 21.63,13.5 v21.97,13.84 | v35.31,14.22 34.5,15.03 U5.D1
  Bottom 0.152: v21.97,13.84 22.12,13.84 22.61,13.36 34.69,13.36 35.31,13.97 v35.31,14.22
AMBIQ_!RST  (via drill 0.3)
  Top 0.152: C17.1 R27.1 11.85,22.95 11.8,23 | v14.97,21.14 14.97,21.93 13.9,23 C6.2 11.8,23 | v34.47,21.67 35,21.14 U5.~RST | 11.8,23 11.15,23 10.93,23.22 v10.93,29.03 | v11.05,33.23 10.08,33.23 S3.4 | S3.3 6.93,33.2 v6.99,33.15
  Bottom 0.152: v14.97,21.14 16.12,22.29 16.91,22.29 17.2,22.58 34.08,22.58 34.47,22.2 v34.47,21.67 34.55,21.59 35.94,21.59 36.2,21.34 36.83,21.34 37.47,21.97 37.47,23.12 36.38,24.2 34.73,24.2 33.78,25.15 33.78,26.24 J5.10 | v10.93,29.03 10.5,29.46 10.5,33.11 10.54,33.15 | v6.99,33.15 10.54,33.15 | 10.54,33.15 10.96,33.15 v11.05,33.23
BOOT  (via drill 0.3)
  Top 0.152: C7.2 R28.2 14.2,27.3 v14.3,27.2 | U5.BOOT 36.5,23.28 v36.88,22.9
  Bottom 0.152: v36.88,22.9 36.29,23.5 18,23.5 v14.3,27.2
CAMERA_DVDD_EN
  Top 0.152: U5.~AD32 23.22,23 19.92,26.3 R11.2 19.5,26.7 19.95,27.15 U3.3
FTDI_VCC
  Top 0.305: J2.4 8.77,18.73 9,18.5 D2.A
GND  (via drill 0.3)
  Top 0.152: U3.2 19,26.8 R11.1 | E1.6 1.98,30.63 1.74,30.63 1.37,30.26 1.37,30.02 E1.3 1.37,29.98 1.37,29.74 1.74,29.37 1.98,29.37 E1.7 2.02,29.37 2.26,29.37 2.63,29.74 2.63,29.98 E1.8 2.63,30.02 2.63,30.26 2.26,30.63 2.02,30.63 E1.6 | E1.6 2,31.04 v2.46,31.5 | E2.6 2.02,10.63 2.26,10.63 2.63,10.26 2.63,10.02 E2.8 2.63,9.98 2.63,9.74 2.26,9.37 2.02,9.37 E2.7 1.98,9.37 1.74,9.37 1.37,9.74 1.37,9.98 E2.3 1.37,10.02 1.37,10.26 1.74,10.63 1.98,10.63 E2.6 | E2.6 2,11.46 1.56,11.9 v0.86,11.9
  other vias: 36.03,26.7 13.84,1.27 6.48,14.86 8.76,12.7 22.23,15.88 28.45,14.48 33.66,14.35 33.53,17.14 39.37,22.86 39.37,17.14 39.37,14.48 20.87,27.35 19.2,32.4 8,34 8.87,27.4 14.48,24.51 21.72,9.78 25.27,10.41 21.59,12.19 19,28.8 29.45,14.48 27.55,24.28 21.2,35.9 14.7,33.4 14.8,35.9 18.97,25.31 6.57,31.5 13.66,10.7 6.46,10.5 11.12,33.99 25.91,16.76 32.13,20.45 37.72,20.32 34.29,32.51 36.07,32.38 19.05,17.53 24.77,35.94
  pour Bottom (isolate 0.152): 0,40 0,0 40,0 40,40
  pour Top (isolate 0.152): 0,40 40,40 40,0 0,0
GPIO4/CAMERA_INT
  Top 0.152: J7.18 22.75,33.6 22.77,33.58 22.77,29.67 25.94,26.5 32.68,26.5 33.02,26.16 33.02,25.53 32.5,25.01 U5.~D4
GPIO5/CAMERA_D5
  Top 0.152: J7.20 23.75,33.33 29.95,27.14 32.9,27.14 34,26.04 U5.~D5
GPIO7/CAMERA_PCLK  (via drill 0.3)
  Top 0.152: U5.D7 33.5,26.11 32.77,26.83 29.8,26.83 27.9,28.74 v27.5,28.74 | v22.22,32.8 22.25,32.83 J7.17
  Bottom 0.152: v22.22,32.8 23.41,32.8 27.47,28.74 v27.5,28.74
GPIO8/CAMERA_I2C_SCL
  Top 0.152: U5.D8 34.5,25.97 33.03,27.44 30.07,27.44 24.25,33.27 J7.21
GPIO9/CAMERA_I2C_SDA
  Top 0.152: J7.22 24.75,33.2 30.2,27.75 33.46,27.75 34.23,26.97 35,26.97 37,24.97 U5.D9
GPIO10/CAMERA_D2  (via drill 0.3)
  Top 0.152: J7.9 18.25,33.53 18.25,32.75 17.5,32 17.5,25.6 21.36,21.74 v25.78,21.74 | U5.D10 36,22.79 35.43,22.23 33.91,22.23 v33.66,21.97
  Bottom 0.152: v33.66,21.97 33.35,22.28 27.61,22.28 26.8,21.46 26.06,21.46 v25.78,21.74
GPIO11/CAMERA_D3
  Top 0.152: J7.5 16.25,33.78 16.25,32.95 16.28,32.92 16.28,25.09 21.18,20.2 25.94,20.2 27.13,19 U5.~AD11
GPIO13/CAMERA_TRIG
  Top 0.152: J7.7 17.25,33.4 17.25,32.61 16.89,32.25 16.89,25.35 21.33,20.9 27.81,20.9 27.91,21 U5.~AD13
GPIO14/CAMERA_D0  (via drill 0.3)
  Top 0.152: U5.D14 30,24.91 29.41,25.5 24.02,25.5 23.5,26.04 v23.5,27.69 | J7.19 23.25,30.09 v24.64,28.7
  Bottom 0.152: v24.64,28.7 24.51,28.7 v23.5,27.69
GPIO15/CAMERA_VSYNC
  Top 0.152: J7.6 16.75,33.27 16.75,32.75 16.59,32.59 16.59,25.22 21.19,20.61 21.31,20.5 U5.D15
GPIO23/CAMERA_D7  (via drill 0.3)
  Top 0.152: J7.13 20.25,33.02 21.84,31.43 21.84,26.8 v22.1,26.54 | U5.~D23 31,24.88 29.77,26.11 25.19,26.11 v24.89,26.42
  Bottom 0.152: v22.1,26.54 22.99,26.54 24,25.53 v24.89,26.42
GPIO24/CAMERA_D0  (via drill 0.3)
  Top 0.152: J7.14 20.75,33.66 20.75,33.02 22.14,31.63 22.14,29.43 22.86,28.71 v22.86,25.91 | U5.~D24 32,25.4 v32.38,25.78
  Bottom 0.152: v22.86,25.91 23.88,24.89 31.37,24.89 32.26,25.78 v32.38,25.78
GPIO26/CAMERA_MCLK
  Top 0.152: J7.8 17.75,33.53 17.75,32.68 17.2,32.13 17.2,25.47 21.46,21.21 27.53,21.21 27.82,21.5 U5.~D26
GPIO27/CAMERA_HSYNC
  Top 0.152: J7.16 21.75,33.09 21.68,33.02 21.68,32.52 22.45,31.75 22.45,29.56 24.1,27.91 24.1,26.32 24.61,25.81 29.55,25.81 30.5,24.86 U5.~D27
GPIO28/CAMERA_D4
  Top 0.152: J7.12 19.75,33.66 19.75,33.09 21.53,31.31 21.53,26.14 22.46,25.2 29.28,25.2 29.5,24.98 U5.~D28
GPIO33/CAMERA_D1  (via drill 0.3)
  Top 0.152: J7.3 15.25,33.78 15.25,33.3 15.98,32.57 15.98,24.97 21.31,19.63 v25.65,19.63 | U5.~AD33/SWO 29.27,19.97 v27.3,19.97
  Bottom 0.152: v27.3,19.97 25.99,19.97 v25.65,19.63
LED_BLUE
  Top 0.152: U5.~D18 30.5,14.07 25.33,8.89 17.4,8.89 17,8.49 R6.2
LED_GREEN  (via drill 0.3)
  Top 0.152: U5.D17 31.5,12.25 v31.47,12.21 | v18,7.8 18.05,7.85 R8.2
  Bottom 0.152: v31.47,12.21 22.41,12.21 v18,7.8
LED_RED
  Top 0.152: U5.~D19 30,14 25.2,9.2 15.6,9.2 15,8.6 R5.2
LED_YELLOW  (via drill 0.3)
  Top 0.152: U5.~D37 38.5,14.7 v35.9,12.1 | v20,7.8 20.05,7.85 R7.2
  Bottom 0.152: v35.9,12.1 32.36,12.1 31.82,11.55 30.99,11.55 30.7,11.85 22.95,11.85 20,8.9 v20,7.8
MIC_CLK  (via drill 0.3)
  Top 0.152: v26.57,22.01 26.58,22 U5.~AD12 | E1.4 3.3,28.14 v3.26,28.1 | E2.4 2.79,9.1 2.41,8.72 v2.41,8.61
  Bottom 0.152: 4,8.61 4,26.27 3.26,27.01 v3.26,28.1 | 4,8.61 4,8.07 5.17,6.89 14.7,6.89 16.3,8.51 16.3,18.55 16.53,18.78 16.53,20.73 18.08,22.28 26.31,22.28 v26.57,22.01 | v2.41,8.61 4,8.61
MIC_DATA  (via drill 0.3)
  Top 0.152: U5.~AD29 27.2,18.5 26.6,19.1 16.1,19.1 v16,19 | E1.1 3.9,30.9 3.79,30.79 3.79,27.88 v3.97,27.7 | E2.1 4.8,11.4 v5.3,11.4
  Bottom 0.152: v16,19 16,9 14.2,7.2 5.3,7.2 4.3,8.2 4.3,11.5 | v3.97,27.7 4.3,27.37 4.3,11.5 | v5.3,11.4 4.4,11.4 4.3,11.5
N$2
  Top 0.152: U5.XI 25.72,17.5 25,16.78 Y2.P$2 24.75,15.5 C9.2
N$5
  Top 0.152: R6.1 D4.A
N$6
  Top 0.152: R5.1 D3.A
N$7
  Top 0.152: R7.1 D5.A
N$8
  Top 0.152: R8.1 D6.A
QWIIC_SCL  (via drill 0.3)
  Top 0.152: J4.4 36.43,30.5 v36.7,30.23 36.77,30.23 37.3,29.7 37.3,25.53 38,24.83 U5.~D39
  Bottom 0.152: v36.7,30.23 TP3.P$1
QWIIC_SDA  (via drill 0.3)
  Top 0.152: J4.3 36,29.5 36.7,28.8 v36.7,27.85 36.7,25.7 37.5,24.9 U5.D40
  Bottom 0.152: v36.7,27.85 37.94,27.85 TP4.P$1
SWDCK  (via drill 0.3)
  Top 0.152: U5.SWDCK 39,23.24 38.84,23.08 38.84,22.64 39,22.48 v39,22
  Bottom 0.152: v39,22 39,22.48 38.84,22.64 38.84,23.08 39,23.24 39,25.77 39.6,26.37 39.6,30.83 34.87,35.56 TP1.P$1 34.29,35.91 33.4,36.8 30.9,36.8 30.1,36 30.1,33.3 30.73,32.67 J5.4
SWDIO  (via drill 0.3)
  Top 0.152: U5.SWDIO 35,25.27 v35.03,25.3
  Bottom 0.152: J5.2 31.16,35.08 31.64,35.56 TP2.P$1 32.77,35.56 35.03,33.29 v35.03,25.3
UART-RX  (via drill 0.3)
  Top 0.152: U5.RXI-0 38.5,23.3 37.17,21.97 v36.7,21.97 | J2.3 5.9,21.87 v5.9,22.5
  Bottom 0.152: v5.9,22.5 5.9,28.08 | 5.9,28.08 12.19,28.08 17.38,22.89 34.27,22.89 35.18,21.97 v36.7,21.97 | 5.9,28.08 4.82,28.08 3.81,29.09 TP6.P$1
UART-TX  (via drill 0.3)
  Top 0.152: v5.4,28.7 4.5,27.8 4.5,24.1 4.79,23.81 J2.2 | U5.TXO-0 35.5,23.28 v35.12,22.9
  Bottom 0.152: TP5.P$1 3.81,31.87 4.8,30.88 4.8,29.3 v5.4,28.7 5.6,28.5 12.2,28.5 17.51,23.19 34.83,23.19 v35.12,22.9
V_BATT  (via drill 0.3)
  Top 0.152: v10,12.2 9.3,12.9 9.3,12.92 8.76,13.45 8.76,16 9.27,16.51 D1.A
  Bottom 0.152: BT1.1 12.05,10.15 v10,12.2
VDD  (via drill 0.3)
  Top 0.152: U3.1 18.05,29 18.45,29.4 20.9,29.4 C22.1 21,30.5 21,31.41 19.25,33.16 19.25,33.53 J7.11 19.25,35.4 19.53,35.68 19.53,37.47 19.5,37.5 | R27.2 10.62,21.5 11.05,21.07 11.05,19.43 11.3,19.18 15.24,19.18 | 15.8,37.5 15.75,37.45 J7.4 | JP1.4 JP1.2
  Top 0.305: U5.VDD@36 29.13,17 28.63,16.5 U5.VDD@37 28.09,16.51 27.48,15.9 C2.2 C11.1 26.28,15.1 25.66,14.48 24.82,14.48 | C4.1 24.85,14.45 24.82,14.48 | J4.2 33.98,28.5 33.53,28.96 33.53,33.48 33.07,33.94 J5.1 32.44,35.16 30.1,37.5 19.5,37.5 15.8,37.5 15.2,38.1 10.28,38.1 8.87,36.69 8.87,32.17 10.05,30.99 12.32,30.99 15.49,27.81 15.49,24.82 16,24.31 16,20.45 15.24,19.68 15.24,19.18 15.24,17.53 16.73,16.04 17.14,16.04 | 17.14,16.04 21.02,16.04 22.58,14.48 24.82,14.48 | v17.14,14.5 17.14,16.04
  Bottom 0.305: J3.1 19.05,1.27 17.27,3.05 17.02,3.05 | v17.14,14.5 17.16,14.49 16.99,14.32 16.99,3.08 17.02,3.05 | JP1.4 17.02,3.05
VDD_ACCEL  (via drill 0.3)
  Top 0.152: U2.3 U2.2 | U2.2 U2.9 | U2.10 U2.9 | C21.1 23.41,11.85 23.06,11.5 C20.1 21.66,11.5 21.41,11.25 U2.9 | 20.32,14.5 R26.1 18.69,14.5 18.41,14.22 18.41,13.21 17.65,12.45 17.65,12.06 17.67,12.05 17.67,11.58 18,11.25 U2.2 | 20.32,14.5 R25.1 | 20.32,14.5 20.32,15.37 v20.38,15.43 | U5.D41 v32.5,17.64 v32.51,17.65
  Bottom 0.152: v20.38,15.43 21.02,15.43 23.37,17.78 32.38,17.78 v32.51,17.65
VDD_PDM  (via drill 0.3)
  Top 0.152: E1.5 4.7,29.5 C18.1 10.64,29.5 10.71,29.57 13.11,29.57 14.99,27.69 14.99,24.79 15.62,24.16 15.62,23.85 v15.39,23.62 | v16.69,22.82 17.14,22.37 v17.14,20.57 | E2.2 3.3,10.16 3.96,9.5 4.32,9.5 | 4.32,9.5 C1.1 5.5,6.57 v5.84,6.22 | E2.5 4.3,9.48 4.32,9.5 | U5.D0 35.5,17.97 v35.69,18.16
  Bottom 0.152: v15.39,23.62 15.89,23.62 v16.69,22.82 | 17.14,18.92 v17.14,20.57 | v5.84,6.22 6.21,6.59 14.82,6.59 16.61,8.38 16.61,18.39 17.14,18.92 | v35.69,18.16 34.92,18.92 17.14,18.92
VIN1
  Top 0.152: JP1.1 JP1.3
  Top 0.305: D2.C D1.C 12.15,10.37 10.16,8.38 JP1.3
X0
  Top 0.152: U5.XO 26.4,18 26.1,18.3 25.05,18.3 Y2.P$1 23.95,18.25 23.7,18.5 C10.2
~44
  Top 0.152: J3.5 33.27,1.27 35,3 35,8 39,12 39,14.09 38.84,14.26 38.84,14.7 39,14.86 U5.~D44
~45
  Top 0.152: U5.~D45 33,7 31.8,5.8 31.8,2.59 J3.4
~A31
  Top 0.152: U5.~AD31 32,7.5 29.3,4.8 29.3,2.63 J3.3
~D22/SWO  (via drill 0.3)
  Top 0.152: U5.~D22 31.5,25.27 v30.86,25.91
  Bottom 0.152: J5.6 30.27,30.51 30.27,26.5 v30.86,25.91

### Text on the board
Bottom: v22
tDocu: Jim Lindblom